# EAGLE schematic ALULab (EAGLE 9.7.0)
AUTHOR: Robert Dettmann; PROJECT_NAME: ALU 74181

## Sheet 1 of 3
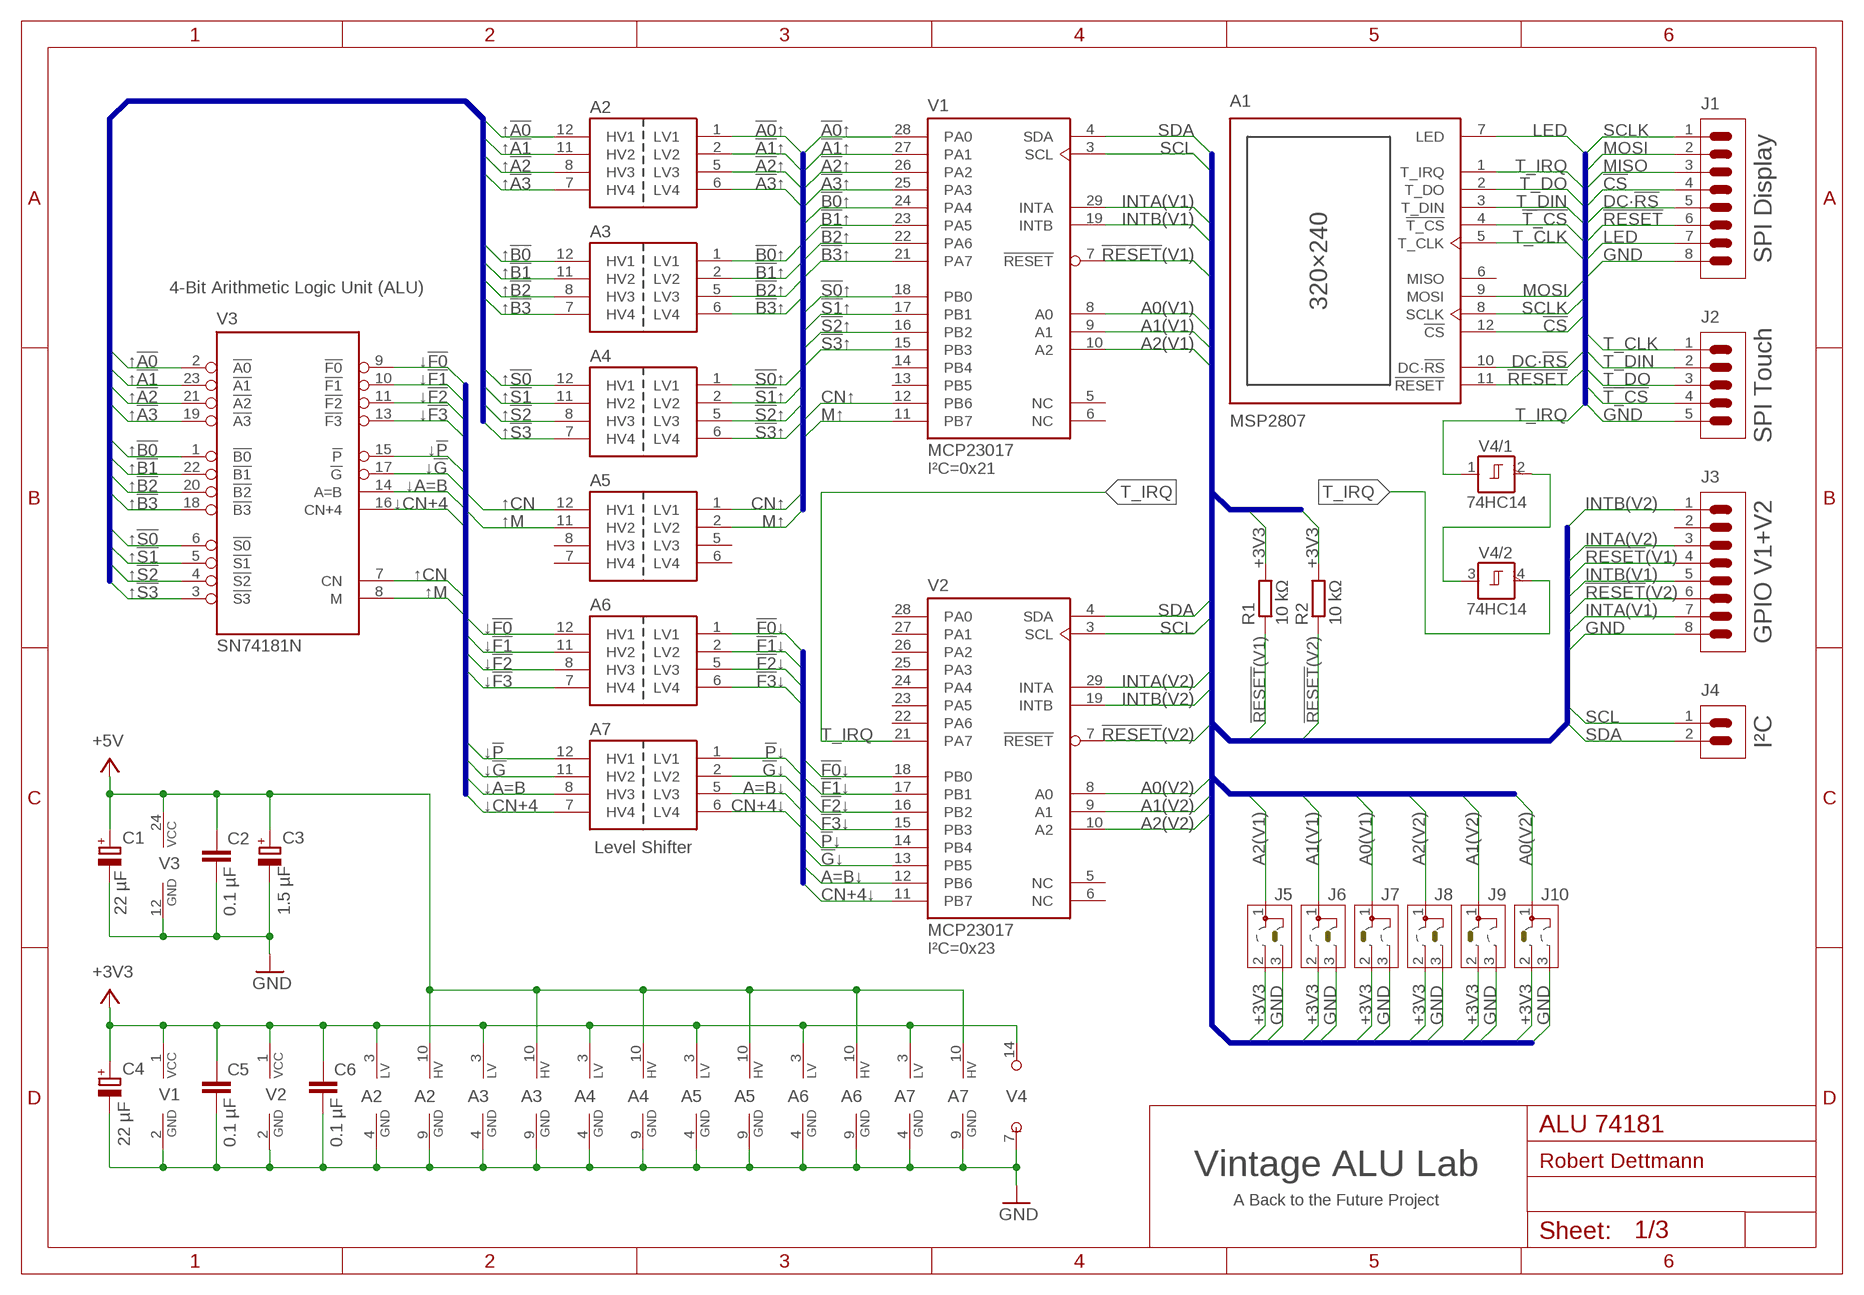
[diagram p0: schematic, sheet 1]

### Parts
A1  MSP2807  [MSP23017]
A2  MODULE-4  [LEVEL-CONVERTER_MODULE-4]
A3  MODULE-4  [LEVEL-CONVERTER_MODULE-4]
A4  MODULE-4  [LEVEL-CONVERTER_MODULE-4]
A5  MODULE-4  [LEVEL-CONVERTER_MODULE-4]
A6  MODULE-4  [LEVEL-CONVERTER_MODULE-4]
A7  MODULE-4  [LEVEL-CONVERTER_MODULE-4]
C1  22 µF  CPOL-EUTT2D4  [TT2D4]
C2  0.1 µF  C-EUC0805  [C0805]
C3  1.5 µF  CPOL-EUTT2D4  [TT2D4]
C4  22 µF  CPOL-EUTT2D4  [TT2D4]
C5  0.1 µF  C-EUC0805  [C0805]
C6  0.1 µF  C-EUC0805  [C0805]
J1  PIN_HEADER_1X8  [PIN_HEADER_1X8]
J2  PIN_HEADER_1X5  [PIN_HEADER_1X5]
J3  PIN_HEADER_2X4  [PIN_HEADER_2X4]
J4  PIN_HEADER_1X2  [PIN_HEADER_1X2]
J5  JUMPER_0-1-0  [JUMPER_0-1-0]
J6  JUMPER_0-1-0  [JUMPER_0-1-0]
J7  JUMPER_0-1-0  [JUMPER_0-1-0]
J8  JUMPER_0-1-0  [JUMPER_0-1-0]
J9  JUMPER_0-1-0  [JUMPER_0-1-0]
J10  JUMPER_0-1-0  [JUMPER_0-1-0]
R1  10 kΩ  R-EU_R0805  [R0805]
R2  10 kΩ  R-EU_R0805  [R0805]
V1  MCP23017  MCP23017MCP23017_BREAKOUT+SOCKET  [MCP23017_BREAKOUT+SOCKET]
V2  MCP23017  MCP23017MCP23017_BREAKOUT+SOCKET  [MCP23017_BREAKOUT+SOCKET]
V3  SN74181N  74HC181  [74181]
V4  74HC14  74HC14:SOCKET+PINS  [DIL14]

### Nets
!A0!↑: A2.1( :LV1) V1.28( :PA0)
!A1!↑: A2.2( :LV2) V1.27( :PA1)
!A2!↑: A2.5( :LV3) V1.26( :PA2)
!A3!↑: A2.6( :LV4) V1.25( :PA3)
!B0!↑: A3.1( :LV1) V1.24( :PA4)
!B1!↑: A3.2( :LV2) V1.23( :PA5)
!B2!↑: A3.5( :LV3) V1.22( :PA6)
!B3!↑: A3.6( :LV4) V1.21( :PA7)
!CS!: A1.12( :!CS!) J1.4
!F0!↓: A6.1( :LV1) V2.18( :PB0)
!F1!↓: A6.2( :LV2) V2.17( :PB1)
!F2!↓: A6.5( :LV3) V2.16( :PB2)
!F3!↓: A6.6( :LV4) V2.15( :PB3)
!G!↓: A7.2( :LV2) V2.13( :PB5)
!P!↓: A7.1( :LV1) V2.14( :PB4)
!RESET!: A1.11( :!RESET!) J1.6
!RESET!(V1): J3.4 R1.1 V1.7( :!RESET!)
!RESET!(V2): J3.6 R2.1 V2.7( :!RESET!)
!S0!↑: A4.1( :LV1) V1.18( :PB0)
!S1!↑: A4.2( :LV2) V1.17( :PB1)
!S2!↑: A4.5( :LV3) V1.16( :PB2)
!S3!↑: A4.6( :LV4) V1.15( :PB3)
!T_CS!: A1.4( :!T_CS!) J2.4
+3V3: A2.3(  :LV) A3.3(  :LV) A4.3(  :LV) A5.3(  :LV) A6.3(  :LV) A7.3(  :LV) C4.+ C5.1 C6.1 J5.2 J6.2 J7.2 J8.2 J9.2 J10.2 R1.2 R2.2 V1.1(  :VCC) V2.1(  :VCC) V4.14(+UB) ; also sheet 2
+5V: A2.10(  :HV) A3.10(  :HV) A4.10(  :HV) A5.10(  :HV) A6.10(  :HV) A7.10(  :HV) C1.+ C2.1 C3.+ V3.24(  :VCC)
A0(V1): J7.1 V1.8( :A0)
A0(V2): J10.1 V2.8( :A0)
A1(V1): J6.1 V1.9( :A1)
A1(V2): J9.1 V2.9( :A1)
A2(V1): J5.1 V1.10( :A2)
A2(V2): J8.1 V2.10( :A2)
A=B↓: A7.5( :LV3) V2.12( :PB6)
CN+4↓: A7.6( :LV4) V2.11( :PB7)
CN↑: A5.1( :LV1) V1.12( :PB6)
DC·!RS!: A1.10( :DC·!RS!) J1.5
GND: A2.4(  :GND) A2.9(  :GND) A3.4(  :GND) A3.9(  :GND) A4.4(  :GND) A4.9(  :GND) A5.4(  :GND) A5.9(  :GND) A6.4(  :GND) A6.9(  :GND) A7.4(  :GND) A7.9(  :GND) C1.- C2.2 C3.- C4.- C5.2 C6.2 J1.8 J2.5 J3.8 J5.3 J6.3 J7.3 J8.3 J9.3 J10.3 V1.2(  :GND) V2.2(  :GND) V3.12(  :GND) V4.7(-UB) ; also sheet 2
INTA(V1): J3.7 V1.29( :INTA)
INTA(V2): J3.3 V2.29( :INTA)
INTB(V1): J3.5 V1.19( :INTB)
INTB(V2): J3.1 V2.19( :INTB)
LED: A1.7( :LED) J1.7
MISO: J1.3
MOSI: A1.9( :MOSI) J1.2
M↑: A5.2( :LV2) V1.11( :PB7)
SCL: J4.1 V1.3( :SCL) V2.3( :SCL)
SCLK: A1.8( :SCLK) J1.1
SDA: J4.2 V1.4( :SDA) V2.4( :SDA)
T_CLK: A1.5( :T_CLK) J2.1
T_DIN: A1.3( :T_DIN) J2.2
T_DO: A1.2( :T_DO) J2.3
T_IRQ: A1.1( :T_IRQ) V2.21( :PA7) V4.1(/1:A) V4.2(/1:Y) V4.3(/2:A) V4.4(/2:Y)
↑!A0!: A2.12( :HV1) V3.2( :!A0!)
↑!A1!: A2.11( :HV2) V3.23( :!A1!)
↑!A2!: A2.8( :HV3) V3.21( :!A2!)
↑!A3!: A2.7( :HV4) V3.19( :!A3!)
↑!B0!: A3.12( :HV1) V3.1( :!B0!)
↑!B1!: A3.11( :HV2) V3.22( :!B1!)
↑!B2!: A3.8( :HV3) V3.20( :!B2!)
↑!B3!: A3.7( :HV4) V3.18( :!B3!)
↑!S0!: A4.12( :HV1) V3.6( :!S0!)
↑!S1!: A4.11( :HV2) V3.5( :!S1!)
↑!S2!: A4.8( :HV3) V3.4( :!S2!)
↑!S3!: A4.7( :HV4) V3.3( :!S3!)
↑CN: A5.12( :HV1) V3.7( :CN)
↑M: A5.11( :HV2) V3.8( :M)
↓!F0!: A6.12( :HV1) V3.9( :!F0!)
↓!F1!: A6.11( :HV2) V3.10( :!F1!)
↓!F2!: A6.8( :HV3) V3.11( :!F2!)
↓!F3!: A6.7( :HV4) V3.13( :!F3!)
↓!G!: A7.11( :HV2) V3.17( :!G!)
↓!P!: A7.12( :HV1) V3.15( :!P!)
↓A=B: A7.8( :HV3) V3.14( :A=B)
↓CN+4: A7.7( :HV4) V3.16( :CN+4)
Unconnected: A1.6( :MISO) A5.5( :LV3) A5.6( :LV4) A5.7( :HV4) A5.8( :HV3) J3.2 V1.5( :NC) V1.6( :NC) V1.13( :PB5) V1.14( :PB4) V2.5( :NC) V2.6( :NC) V2.22( :PA6) V2.23( :PA5) V2.24( :PA4) V2.25( :PA3) V2.26( :PA2) V2.27( :PA1) V2.28( :PA0) V4.5(/3:A) V4.6(/3:Y) V4.8(/4:Y) V4.9(/4:A) V4.10(/5:Y) V4.11(/5:A) V4.12(/6:Y) V4.13(/6:A)

### Buses
74181:↑!A0!,↑!A1!,↑!A2!,↑!A3!,↓A=B,↑!B0!,↑!B1!,↑!B2!,↑!B3!,↑CN,↓CN+4,↓!F0!,↓!F1!,↓!F2!,↓!F3!,↓!G!,GND,↑M,↓!P!,↑!S0!,↑!S1!,↑!S2!,↑!S3!
!CS!,DC·!RS!,GND,LED,MISO,MOSI,!RESET!,SCLK,T_CLK,!T_CS!,T_DIN,T_DO,T_IRQ
!A0!↑,!A1!↑,!A2!↑,!A3!↑,!B0!↑,!B1!↑,!B2!↑,!B3!↑,CN↑,M↑,!S0!↑,!S1!↑,!S2!↑,!S3!↑
↓A=B,↑CN,↓CN+4,↓!F0!,↓!F1!,↓!F2!,↓!F3!,↓!G!,↑M,↓!P!
+3V3,A0(V1),A0(V2),A1(V1),A1(V2),A2(V1),A2(V2),GND,INTA(V1),INTA(V2),INTB(V1),INTB(V2),!RESET!(V1),!RESET!(V2),SCL,SDA
A=B↓,CN+4↓,!F0!↓,!F1!↓,!F2!↓,!F3!↓,!G!↓,!P!↓

### Notes on the sheet
- SPI Display
- 4-Bit Arithmetic Logic Unit (ALU)
- SPI Touch
- I²C=0x21
- GPIO V1+V2
- I²C
- Level Shifter
- I²C=0x23
- V4
- Vintage ALU Lab
- A Back to the Future Project

## Sheet 2 of 3
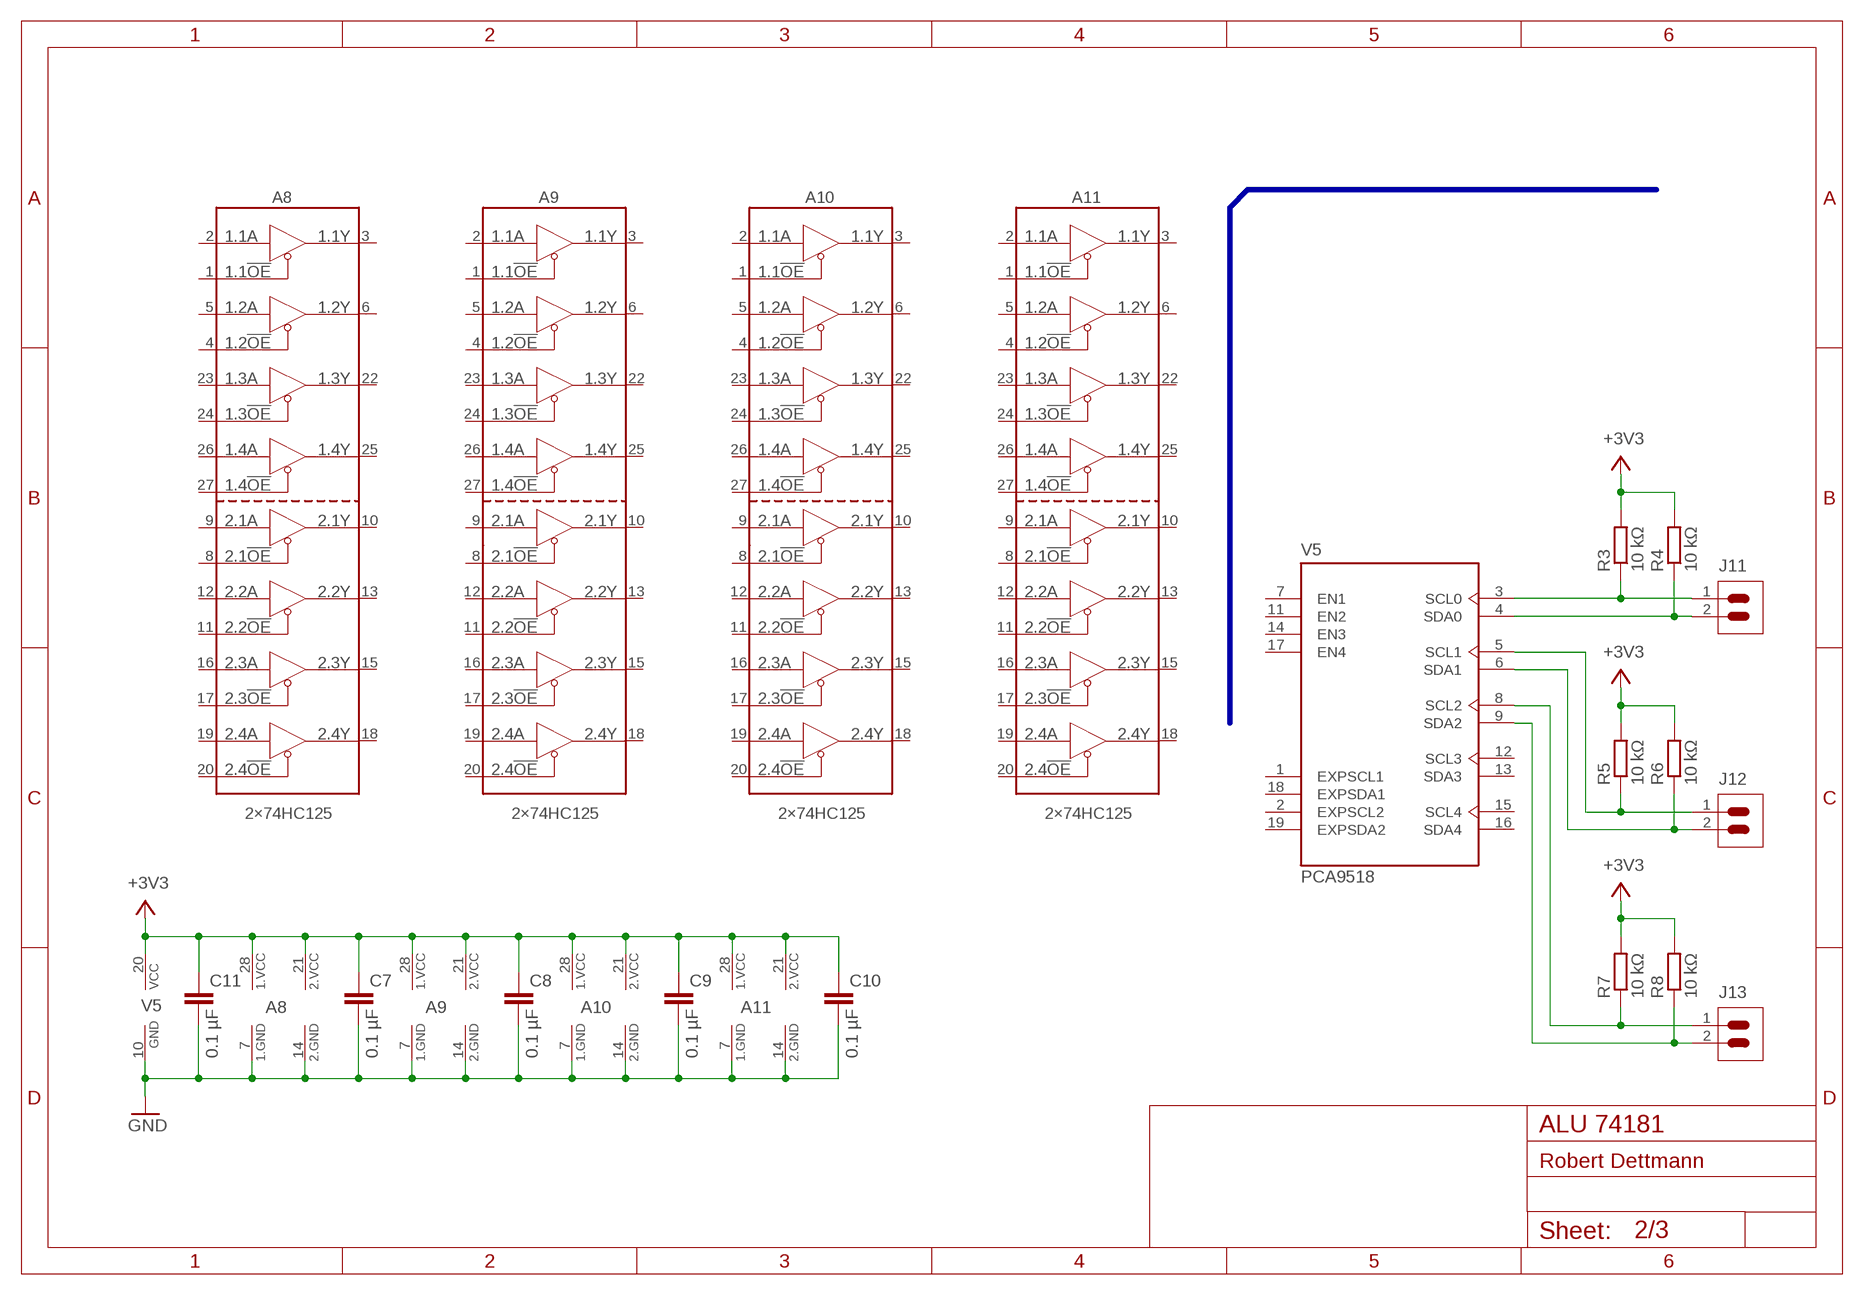
[diagram p1: schematic, sheet 2]

### Parts
A8  2×74HC125  74HC125.DUAL  [74HC125.DUAL]
A9  2×74HC125  74HC125.DUAL  [74HC125.DUAL]
A10  2×74HC125  74HC125.DUAL  [74HC125.DUAL]
A11  2×74HC125  74HC125.DUAL  [74HC125.DUAL]
C7  0.1 µF  C-EUC0805  [C0805]
C8  0.1 µF  C-EUC0805  [C0805]
C9  0.1 µF  C-EUC0805  [C0805]
C10  0.1 µF  C-EUC0805  [C0805]
C11  0.1 µF  C-EUC0805  [C0805]
J11  PIN_HEADER_1X2  [PIN_HEADER_1X2]
J12  PIN_HEADER_1X2  [PIN_HEADER_1X2]
J13  PIN_HEADER_1X2  [PIN_HEADER_1X2]
R3  10 kΩ  R-EU_R0805  [R0805]
R4  10 kΩ  R-EU_R0805  [R0805]
R5  10 kΩ  R-EU_R0805  [R0805]
R6  10 kΩ  R-EU_R0805  [R0805]
R7  10 kΩ  R-EU_R0805  [R0805]
R8  10 kΩ  R-EU_R0805  [R0805]
V5  PCA9518  [PCA9518]

### Nets
+3V3: A8.21(  :2.VCC) A8.28(  :1.VCC) A9.21(  :2.VCC) A9.28(  :1.VCC) A10.21(  :2.VCC) A10.28(  :1.VCC) A11.21(  :2.VCC) A11.28(  :1.VCC) C7.1 C8.1 C9.1 C10.1 C11.1 R3.2 R4.2 R5.2 R6.2 R7.2 R8.2 V5.20(  :VCC) ; also sheet 1
GND: A8.7(  :1.GND) A8.14(  :2.GND) A9.7(  :1.GND) A9.14(  :2.GND) A10.7(  :1.GND) A10.14(  :2.GND) A11.7(  :1.GND) A11.14(  :2.GND) C7.2 C8.2 C9.2 C10.2 C11.2 V5.10(  :GND) ; also sheet 1
SC0: J11.1 R3.1 V5.3( :SCL0)
SC1: R5.1
SC2: R7.1
SCL1: J12.1 V5.5( :SCL1)
SCL2: J13.1 V5.8( :SCL2)
SDA0: J11.2 R4.1 V5.4( :SDA0)
SDA1: J12.2 V5.6( :SDA1)
SDA2: J13.2 V5.9( :SDA2)
SDA3: R6.1
SDA4: R8.1
Unconnected: A8.1( :1.1!OE!) A8.2( :1.1A) A8.3( :1.1Y) A8.4( :1.2!OE!) A8.5( :1.2A) A8.6( :1.2Y) A8.8( :2.1!OE!) A8.9( :2.1A) A8.10( :2.1Y) A8.11( :2.2!OE!) A8.12( :2.2A) A8.13( :2.2Y) A8.15( :2.3Y) A8.16( :2.3A) A8.17( :2.3!OE!) A8.18( :2.4Y) A8.19( :2.4A) A8.20( :2.4!OE!) A8.22( :1.3Y) A8.23( :1.3A) A8.24( :1.3!OE!) A8.25( :1.4Y) A8.26( :1.4A) A8.27( :4!OE!) A9.1( :1.1!OE!) A9.2( :1.1A) A9.3( :1.1Y) A9.4( :1.2!OE!) A9.5( :1.2A) A9.6( :1.2Y) A9.8( :2.1!OE!) A9.9( :2.1A) A9.10( :2.1Y) A9.11( :2.2!OE!) A9.12( :2.2A) A9.13( :2.2Y) A9.15( :2.3Y) A9.16( :2.3A) A9.17( :2.3!OE!) A9.18( :2.4Y) A9.19( :2.4A) A9.20( :2.4!OE!) A9.22( :1.3Y) A9.23( :1.3A) A9.24( :1.3!OE!) A9.25( :1.4Y) A9.26( :1.4A) A9.27( :4!OE!) A10.1( :1.1!OE!) A10.2( :1.1A) A10.3( :1.1Y) A10.4( :1.2!OE!) A10.5( :1.2A) A10.6( :1.2Y) A10.8( :2.1!OE!) A10.9( :2.1A) A10.10( :2.1Y) A10.11( :2.2!OE!) A10.12( :2.2A) A10.13( :2.2Y) A10.15( :2.3Y) A10.16( :2.3A) A10.17( :2.3!OE!) A10.18( :2.4Y) A10.19( :2.4A) A10.20( :2.4!OE!) A10.22( :1.3Y) A10.23( :1.3A) A10.24( :1.3!OE!) A10.25( :1.4Y) A10.26( :1.4A) A10.27( :4!OE!) A11.1( :1.1!OE!) A11.2( :1.1A) A11.3( :1.1Y) A11.4( :1.2!OE!) A11.5( :1.2A) A11.6( :1.2Y) A11.8( :2.1!OE!) A11.9( :2.1A) A11.10( :2.1Y) A11.11( :2.2!OE!) A11.12( :2.2A) A11.13( :2.2Y) A11.15( :2.3Y) A11.16( :2.3A) A11.17( :2.3!OE!) A11.18( :2.4Y) A11.19( :2.4A) A11.20( :2.4!OE!) A11.22( :1.3Y) A11.23( :1.3A) A11.24( :1.3!OE!) A11.25( :1.4Y) A11.26( :1.4A) A11.27( :4!OE!) V5.1( :EXPSCL1) V5.2( :EXPSCL2) V5.7( :EN1) V5.11( :EN2) V5.12( :SCL3) V5.13( :SDA3) V5.14( :EN3) V5.15( :SCL4) V5.16( :SDA4) V5.17( :EN4) V5.18( :EXPSDA1) V5.19( :EXPSDA2)

### Buses
A.T_CLK,A.T_CS,A.T_DI,A.T_DO,B.T_CLK,B.T_CS,B.T_DI,B.TDO,Y.T_CLK,Y.T_CS,Y.T_DI,Y.T_DO

## Sheet 3 of 3

## Power pins joined to a net without a drawn wire
GND: A1.13(  :GND)
VCC: A1.14(  :VCC)

## Library data of the parts
A1 = ImplicateX.Display:MSP2807
A2-A7 = ImplicateX.LevelConverter:MODULE-4
A8-A11 = ImplicateX.LogicCircuit:74HC125.DUAL
C1 C3 C4 = qfm-trx1-24g:CPOL-EU: POLARIZED CAPACITOR, European symbol
C2 C5-C11 = resistor:C-EU: CAPACITOR, European symbol
J1 = ImplicateX.Connector:PIN_HEADER_1X8
J2 = ImplicateX.Connector:PIN_HEADER_1X5
J3 = ImplicateX.Connector:PIN_HEADER_2X4
J4 J11-J13 = ImplicateX.Connector:PIN_HEADER_1X2
J5-J10 = ImplicateX.Connector:JUMPER_0-1-0
R1-R8 = resistor:R-EU_: RESISTOR, European symbol
V1 V2 = ImplicateX.LogicCircuit:MCP23017
V3 = ImplicateX.LogicCircuit:74HC181
V4 = ImplicateX.LogicCircuit:74HC14:SOCKET+PINS: Hex schmitt trigger INVERTER
V5 = ImplicateX.LogicCircuit:PCA9518